# EasyEDA Pro project ProPrj_V1_2025-01-17.epro, schematic Schematic1
Board Name: Board1; Create Date: 2025-01-15; Page Name: P1; Project Name: V1; Schematic Name: Schematic1; Update Date: 2025-01-17; Company: 嘉立创EDA; Page Size: A4; Version: V1.1 ES
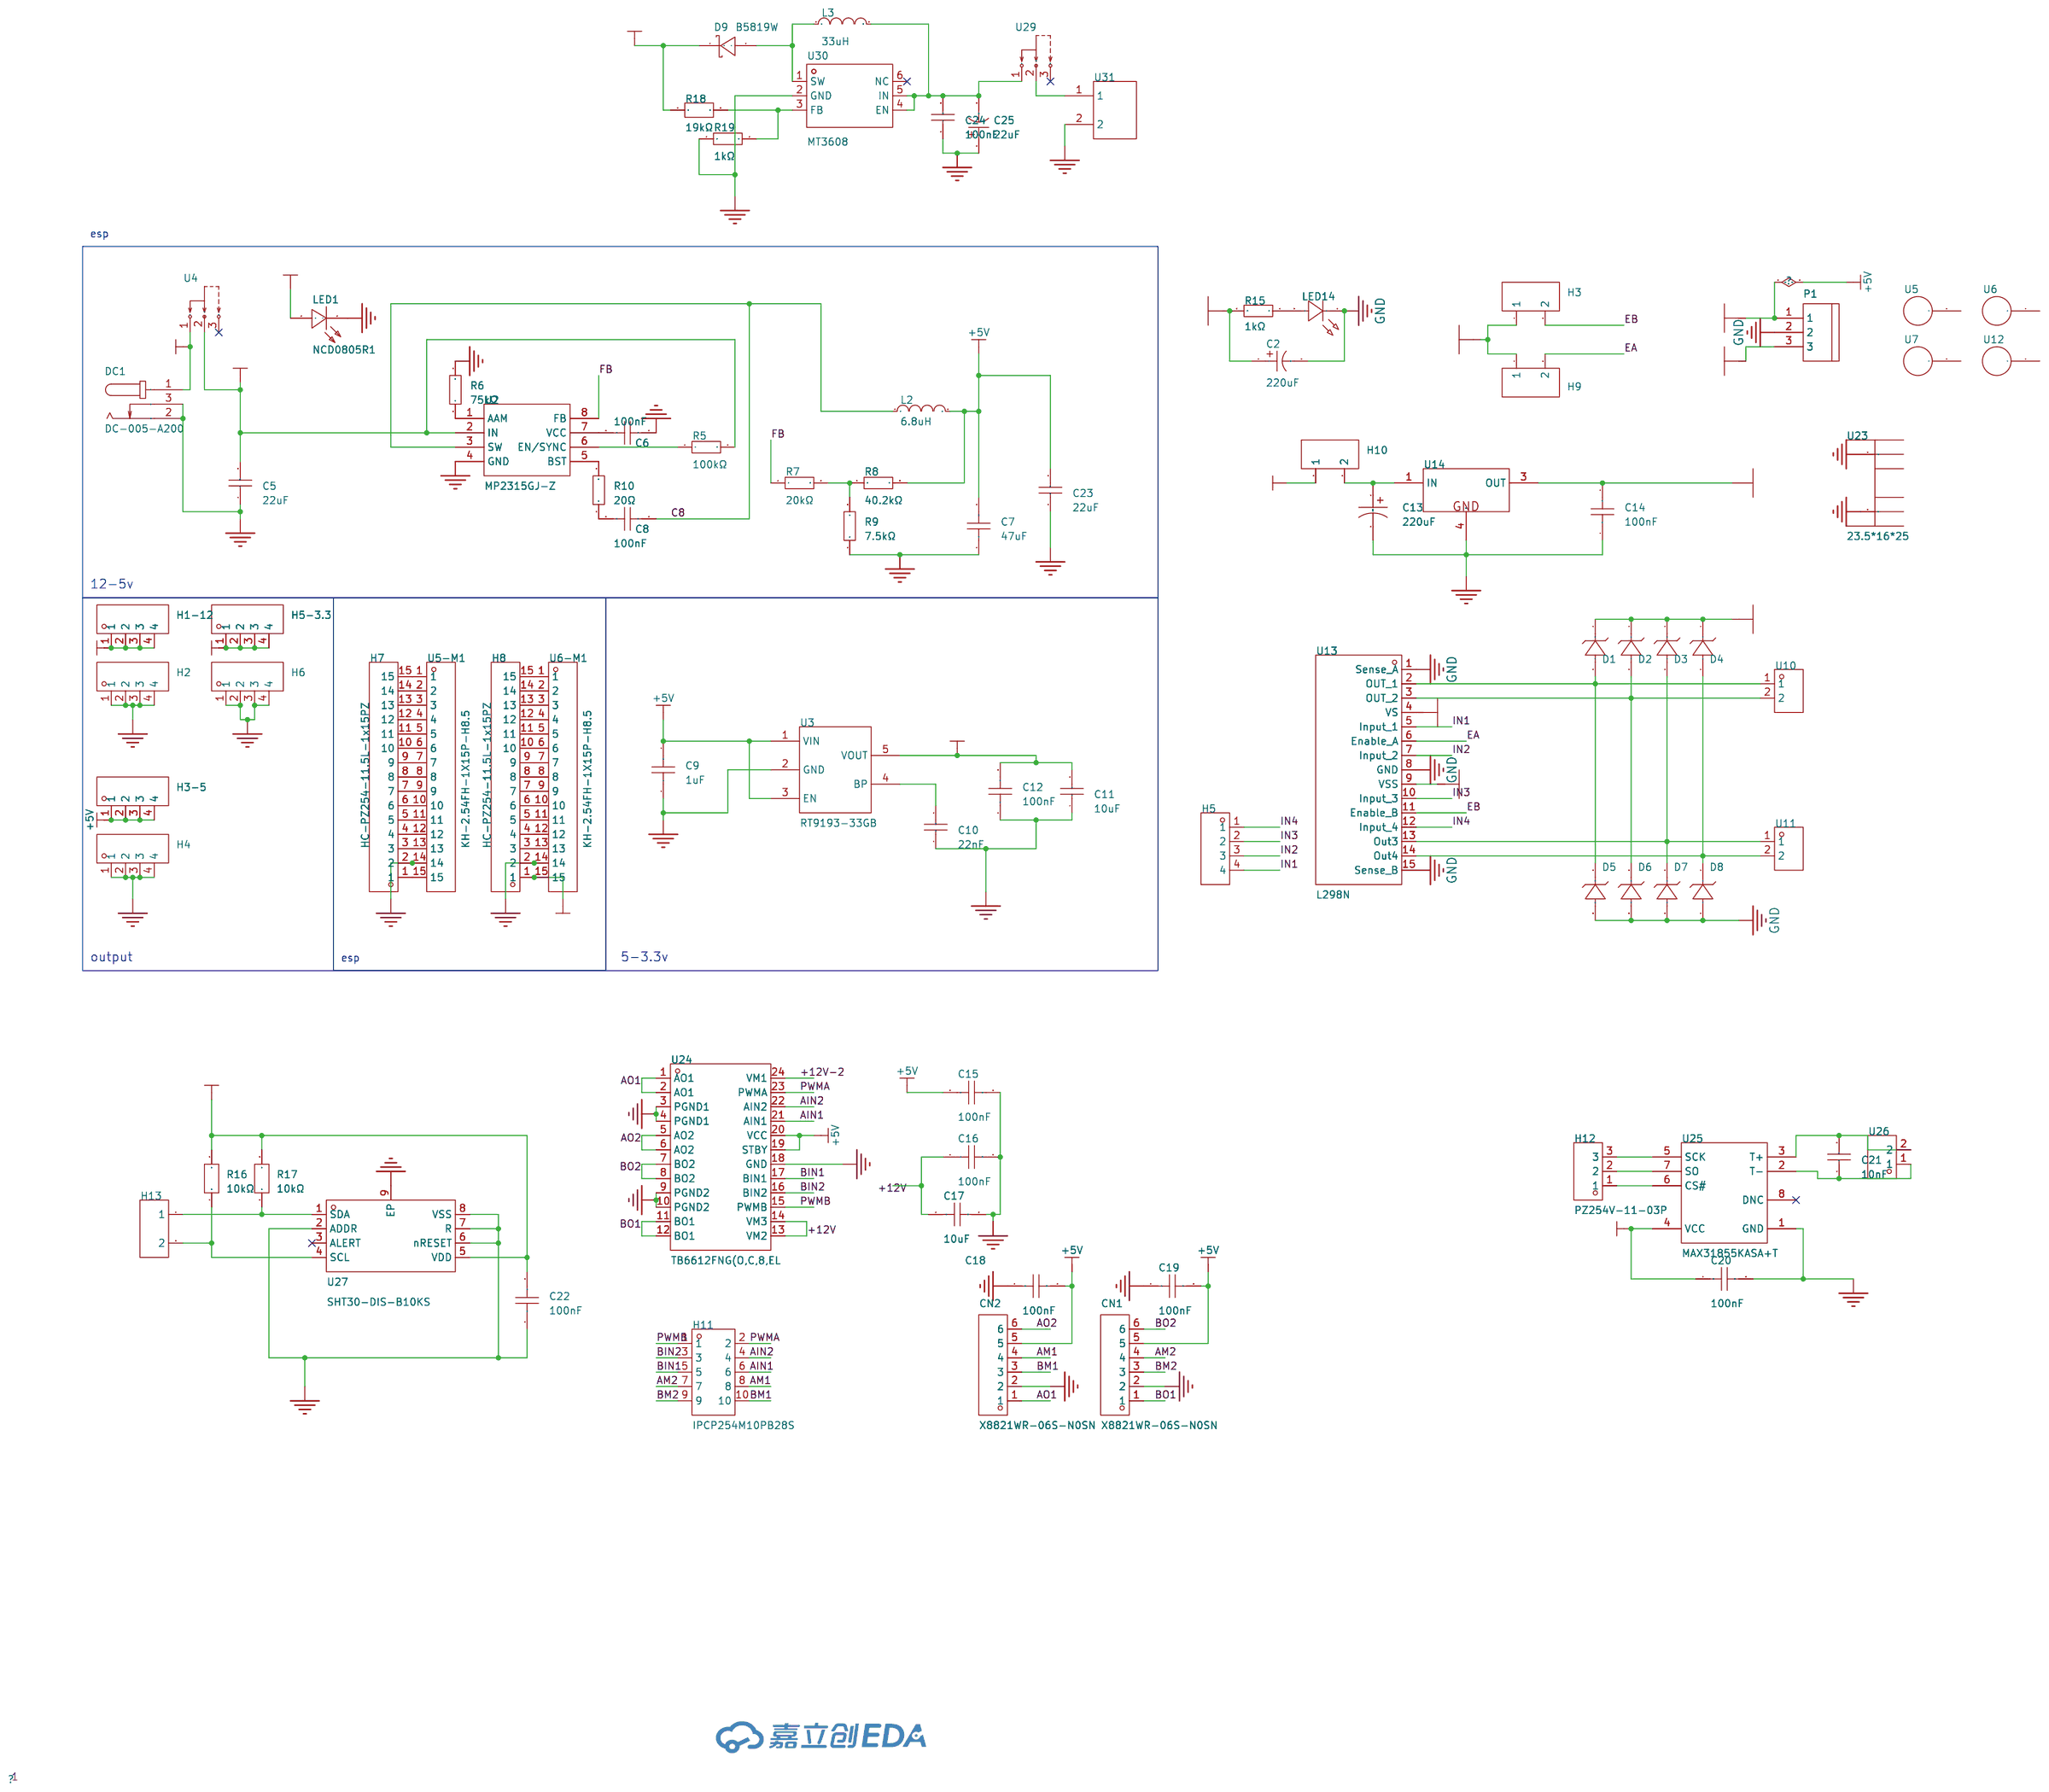
[diagram p0: schematic sheet]

## Parts
C2  220uF  [CAP-SMD_BD8.0-L8.3-W8.3-LS9.3-FD]
C5  22uF  [C1206]
C6  100nF  [C0603]
C7  47uF  [C1210]
C8  100nF  [C0603]
C9  1uF  [C0603]
C10  22nF  [C0603]
C11  10uF  [C1206]
C12  100nF  [C0603]
C13  220uF  [CAP-SMD_BD10.0-L10.3-W10.3-LS11.3-FD]
C14  100nF  [C0603]
C15  100nF  [C0603]
C16  100nF  [C0603]
C17  10uF  [C1206]
C18  100nF  [C0603]
C19  100nF  [C0603]
C20  100nF  [C0603]
C21  10nF  [C0603]
C22  100nF  [C0603]
C23  22uF  [C1206]
C24  100nF  [C0603]
C25  22uF  [CAP-SMD_BD6.3-L6.6-W6.6-FD]
CN1  X8821WR-06S-N0SN  [CONN-TH_6P-P2.50_X8821WR-06S-N2SN]
CN2  X8821WR-06S-N0SN  [CONN-TH_6P-P2.50_X8821WR-06S-N2SN]
D1  -  [SOD-123FL_L2.7-W1.8-LS3.8-RD]
D2  -  [SOD-123FL_L2.7-W1.8-LS3.8-RD]
D3  -  [SOD-123FL_L2.7-W1.8-LS3.8-RD]
D4  -  [SOD-123FL_L2.7-W1.8-LS3.8-RD]
D5  -  [SOD-123FL_L2.7-W1.8-LS3.8-RD]
D6  -  [SOD-123FL_L2.7-W1.8-LS3.8-RD]
D7  -  [SOD-123FL_L2.7-W1.8-LS3.8-RD]
D8  -  [SOD-123FL_L2.7-W1.8-LS3.8-RD]
D9  B5819W  [SOD-123_L2.8-W1.8-LS3.7-RD]
DC1  DC-005-A200  [DC-IN-TH_DC-005-A200]
H1-12  PZ254V-11-04P  [HDR-TH_4P-P2.54-V-M]
H2  PZ254V-11-04P  [HDR-TH_4P-P2.54-V-M]
H3  -  [HDR-TH_2P-P2.54-V-M-1]
H3-5  PZ254V-11-04P  [HDR-TH_4P-P2.54-V-M]
H4  PZ254V-11-04P  [HDR-TH_4P-P2.54-V-M]
H5  826629-4  [HDR-TH_4P-P2.54-V-M-1]
H5-3.3  PZ254V-11-04P  [HDR-TH_4P-P2.54-V-M]
H6  PZ254V-11-04P  [HDR-TH_4P-P2.54-V-M]
H7  HC-PZ254-11.5L-1x15PZ  [HDR-TH_15P-P2.54-V-M-1]
H8  HC-PZ254-11.5L-1x15PZ  [HDR-TH_15P-P2.54-V-M-1]
H9  -  [HDR-TH_2P-P2.54-V-M-1]
H10  -  [HDR-TH_2P-P2.54-V-M-1]
H11  IPCP254M10PB28S  [HDR-SMD_10P-P2.54-V-M-R2-C5-S2.54-LS7.3]
H12  PZ254V-11-03P  [HDR-TH_3P-P2.54-V-M]
H13  -  [HDR-TH_2P-P2.54-V-M-1]
L2  6.8uH  [IND-SMD_L7.0-W6.6]
L3  33uH  [IND-SMD_L12.3-W12.3]
LED1  NCD0805R1  [LED0805-R-RD]
LED14  -  [LED0805-RD_BLUE]
P1  -  [CONN-TH_3P-P5.00_WJ500V-5.08-3P]
R5  100kΩ  [R0603]
R6  75kΩ  [R0603]
R7  20kΩ  [R0603]
R8  40.2kΩ  [R0402]
R9  7.5kΩ  [R0603]
R10  20Ω  [R0805]
R15  1kΩ  [R0805]
R16  10kΩ  [R0603]
R17  10kΩ  [R0603]
R18  19kΩ  [R0805]
R19  1kΩ  [R0603]
U2  MP2315GJ-Z  [TSOT-23-8_L2.9-W1.6-P0.65-LS2.8-BR]
U3  RT9193-33GB  [SOT-23-5_L3.0-W1.7-P0.95-LS2.8-BL]
U4  SS12D10G5  [SW-TH_SHOU-HAN_SS12D10G4]
U5  -  [SMD_BD4.2-L4.7-W4.7-D3.0]
U5-M1  KH-2.54FH-1X15P-H8.5  [HDR-TH_15P-P2.54-V-F]
U6  -  [SMD_BD4.2-L4.7-W4.7-D3.0]
U6-M1  KH-2.54FH-1X15P-H8.5  [HDR-TH_15P-P2.54-V-F]
U7  -  [SMD_BD4.2-L4.7-W4.7-D3.0]
U10  -  [CONN-TH_DB302-5.0-2P]
U11  -  [CONN-TH_DB302-5.0-2P]
U12  -  [SMD_BD4.2-L4.7-W4.7-D3.0]
U13  L298N  [MULTIWATT-15_L19.6-W5.0-P1.27-L]
U14  L78M05ABDT-TR  [TO-252-2_L6.5-W6.1-P4.58-LS10.0-TL]
U23  23.5*16*25  [HEATSINK-TH_L23.5-W16.0-P18.0_XSD2156-067]
U24  TB6612FNG(O,C,8,EL  [SSOP-24_L8.4-W5.8-P0.65-LS7.8-BL]
U25  MAX31855KASA+T  [SO-8_L4.9-W3.9-P1.27-LS5.9-BL]
U26  -  [CONN-TH_DB302-5.0-2P]
U27  SHT30-DIS-B10KS  [DFN-8_L2.5-W2.5-P0.50-BL-EP]
U29  SS12D10G5  [SW-TH_SHOU-HAN_SS12D10G4]
U30  MT3608  [SOT-23-6_L2.9-W1.6-P0.95-LS2.8-BL]
U31  -  [PWR]

## Library data of the parts
C2 = EMK1VM221FB0D00R: 容值:220uF;精度:±20%;额定电压:35V;电容体直径:-;电容体长度:-;纹波电流:-;等效串联电阻:-;工作寿命:-;工作温度:-;; LCSC Part Name: 220uF ±20% 35V; Supplier Part: C724731; Manufacturer: AISHI(艾华集团); Supplier Footprint: SMD,8x10.5mm; JLCPCB Part Class: Extended Part; Datasheet: https://atta.szlcsc.com/upload/public/pdf/source/20200818/C724731_E3C3C738DF50876976EE53B5D20E1717.pdf; Supplier: LCSC; Tolerance: ±20%; Rated Voltage: 35V
C5 C23 = CL31A226KAHNNNE: 容值:22uF;精度:±10%;额定电压:25V;材质(温度系数):X5R;; LCSC Part Name: 22uF ±10% 25V; Supplier Part: C12891; Manufacturer: SAMSUNG(三星); Supplier Footprint: 1206; JLCPCB Part Class: 基础库; Datasheet: https://atta.szlcsc.com/upload/public/pdf/source/20160218/1457707763339.pdf; Supplier: LCSC; Tolerance: ±10%; Voltage Rated: 25V; Temperature Coefficient: X5R
C6 C8 C12 = CC0603KRX7R9BB104: 容值:100nF;精度:±10%;额定电压:50V;材质(温度系数):X7R;; LCSC Part Name: 100nF ±10% 50V; Supplier Part: C14663; Manufacturer: YAGEO(国巨); Supplier Footprint: 0603; JLCPCB Part Class: 基础库; Datasheet: https://atta.szlcsc.com/upload/public/pdf/source/20180910/C282072_33301C7F631E79921B82A8DAC6BCC5B3.pdf; Supplier: LCSC; Tolerance: ±10%; Voltage Rated: 50V; Temperature Coefficient: X7R
C7 = GRM32ER61C476KE15L: 容值:47uF;精度:±10%;额定电压:16V;材质(温度系数):X5R;; LCSC Part Name: 47uF ±10% 16V; Supplier Part: C77101; Manufacturer: muRata(村田); Supplier Footprint: 1210; JLCPCB Part Class: 扩展库; Datasheet: https://atta.szlcsc.com/upload/public/pdf/source/20221202/FF58125DCA7AB78AED268D88B743009A.pdf; Supplier: LCSC; Tolerance: ±10%; Voltage Rated: 16V; Temperature Coefficient: X5R
C9 = CL10A105KB8NNNC: 容值:1uF;精度:±10%;额定电压:50V;材质(温度系数):X5R;; LCSC Part Name: 1uF ±10% 50V; Supplier Part: C15849; Manufacturer: SAMSUNG(三星); Supplier Footprint: 0603; JLCPCB Part Class: Basic Part; Datasheet: https://atta.szlcsc.com/upload/public/pdf/source/20160218/1457707763339.pdf; Supplier: LCSC; Tolerance: ±10%; Voltage Rated: 50V; Temperature Coefficient: X5R
C10 = CL10B223KB8NNNC: 容值:22nF;精度:±10%;额定电压:50V;材质(温度系数):X7R;; LCSC Part Name: 22nF ±10% 50V; Supplier Part: C21122; Manufacturer: SAMSUNG(三星); Supplier Footprint: 0603; JLCPCB Part Class: 基础库; Datasheet: https://atta.szlcsc.com/upload/public/pdf/source/20160218/1457707763339.pdf; Supplier: LCSC; Tolerance: ±10%; Voltage Rated: 50V; Temperature Coefficient: X7R
C11 = CL31A106KBHNNNE: 容值:10uF;精度:±10%;额定电压:50V;材质(温度系数):X5R;; LCSC Part Name: 10uF ±10% 50V; Supplier Part: C13585; Manufacturer: SAMSUNG(三星); Supplier Footprint: 1206; JLCPCB Part Class: Basic Part; Datasheet: https://atta.szlcsc.com/upload/public/pdf/source/20160218/1457707763339.pdf; Supplier: LCSC; Tolerance: ±10%; Voltage Rated: 50V; Temperature Coefficient: X5R
C13 = HV1H227M1010PZ: 容值:220uF;精度:±20%;额定电压:50V;; LCSC Part Name: 220uF ±20% 50V; Supplier Part: C5246564; Manufacturer: HONOR(荣誉); Supplier Footprint: SMD,D10xL10mm; JLCPCB Part Class: 扩展库; Datasheet: https://atta.szlcsc.com/upload/public/pdf/source/20221103/F889AFCC379E96C645A0A58E4BAC43B0.pdf; Supplier: LCSC; Tolerance: ±20%; Rated Voltage: 50V; φD: 10mm; L: 10mm; Operating Temperature: -55℃~+105℃
C14-C16 C18-C20 C22 = CGA0603X7R104K500JT: 容值:100nF;精度:±10%;额定电压:50V;材质(温度系数):X7R;; LCSC Part Name: 100nF ±10% 50V; Supplier Part: C6119867; Manufacturer: HRE(芯声); Supplier Footprint: 0603; JLCPCB Part Class: 扩展库; Supplier: LCSC; Tolerance: ±10%; Voltage Rated: 50V; Temperature Coefficient: X7R
C17 = HGC1206R5106K500NSPJ: 容值:10uF;精度:±10%;额定电压:50V;材质(温度系数):X5R;; LCSC Part Name: 10uF ±10% 50V; Supplier Part: C7432781; Manufacturer: Chinocera(华瓷); Supplier Footprint: 1206; JLCPCB Part Class: 扩展库; Datasheet: https://atta.szlcsc.com/upload/public/pdf/source/20240320/FAC3FEC40A78BC5CCCE96C232A94D860.pdf; Supplier: LCSC; Tolerance: ±10%; Voltage Rated: 50V; Temperature Coefficient: X5R
C21 = CC0603KRX7R9BB103: 容值:10nF;精度:±10%;额定电压:50V;材质(温度系数):X7R;; LCSC Part Name: 10nF ±10% 50V; Supplier Part: C100042; Manufacturer: YAGEO(国巨); Supplier Footprint: 0603; JLCPCB Part Class: 扩展库; Datasheet: https://atta.szlcsc.com/upload/public/pdf/source/20181008/C309510_22F155564471FAF6A489F7D68F34234E.pdf; Supplier: LCSC; Tolerance: ±10%; Voltage Rated: 50V; Temperature Coefficient: X7R
C24 = CT41G-0603-2X1-50V-0.1μF-K(N): 容值:100nF;精度:±10%;额定电压:50V;材质(温度系数):-;; LCSC Part Name: 100nF ±10% 50V; Supplier Part: C125205; Manufacturer: TORCH(火炬); Supplier Footprint: 0603; JLCPCB Part Class: 扩展库; Datasheet: https://atta.szlcsc.com/upload/public/pdf/source/20171225/C150708_15141883600121203188.pdf; Supplier: LCSC; Tolerance: ±10%; Voltage Rated: 50V
C25 = RVT22UF50V67RV0028: 容值:22uF;精度:±20%;额定电压:50V;纹波电流:43mA@120Hz;等效串联电阻:-;; LCSC Part Name: 22uF ±20% 50V; Supplier Part: C2836438; Manufacturer: KNSCHA(科尼盛); Supplier Footprint: SMD,D6.3xL5.4mm; JLCPCB Part Class: 扩展库; Datasheet: https://atta.szlcsc.com/upload/public/pdf/source/20210528/C2836438_BFA13B3627CC6B20ADD0B3BB98082A71.pdf; Supplier: LCSC; Tolerance: ±20%; Rated Voltage: 50V; Ripple Current: 43mA@120Hz; φD: 6.3mm; L: 5.4mm; Lifetime @ Temp: 2000hrs@105℃; Operating Temperature: -55℃~+105℃
CN1 CN2 = X8821WR-06S-N0SN: 插针结构:1x6P;间距:2.5mm;安装方式:弯插;参考系列:XH;总PIN数:6P;排数:1;每排PIN数:6;行距:-;额定电流:3A;触头材质:黄铜;触头镀层:锡;工作温度范围:-;; LCSC Part Name: 1x6P 间距:2.5mm 弯插 系列:XH; Supplier Part: C388743; Manufacturer: XKB Connection(中国星坤); Supplier Footprint: 弯插,P=2.54mm; JLCPCB Part Class: 扩展库; Datasheet: https://atta.szlcsc.com/upload/public/pdf/source/20211009/984C14C41D2B1156BCF8EEF5D296E395.pdf; Supplier: LCSC; Pins Structure: 1x6P; Pitch: 2.5mm; Mounting Style: 弯插; Reference Series: XH; Number of Pins: 6P; Number of Rows: 1; Number of PINs Per Row: 6; Current Rating (Max): 3A; Contact Material: 黄铜; Contact Plating: 锡
D1-D8 = 1N4007: 二极管配置:独立式;直流反向耐压(Vr):1kV;平均整流电流(Io):1A;正向压降(Vf):1.1V@1A;反向电流(Ir):10A@1kV;; LCSC Part Name: 1kV 1A 1.1V@1A; Supplier Part: C727082; Manufacturer: TWGMC(台湾迪嘉); Supplier Footprint: SOD-123FL; JLCPCB Part Class: Extended Part; Datasheet: https://atta.szlcsc.com/upload/public/pdf/source/20200828/C727082_2F914037E829F0E2238583225D7ED281.pdf; Supplier: LCSC; Diode Configuration: 独立式; Reverse Voltage (Vr): 1kV; Average Rectified Current (Io): 1A; Forward Voltage (Vf@If): 1.1V@1A; Reverse Leakage Current: 10A@1kV
D9 = B5819W_C64885: 二极管配置:独立式;正向压降(Vf):900mV@3A;直流反向耐压(Vr):40V;整流电流:1A;; LCSC Part Name: 电压:40V 电流:1A 丝印SL; Supplier Part: C64885; Manufacturer: MDD(辰达半导体); Supplier Footprint: SOD-123; JLCPCB Part Class: 扩展库; Datasheet: https://atta.szlcsc.com/upload/public/pdf/source/20241121/1336DB1C0E60AD8FEBA9F692F8955C35.pdf; Supplier: LCSC; Diode Configuration: 独立式; Forward Voltage (Vf@If): 900mV@3A; Reverse Voltage (Vr): 40V; Rectified Current: 1A; Reverse Leakage Current (Ir): 1mA@40V
DC1 = DC-005-A200: 连接器类型:DC电源插座;安装方式:弯插;触点内径:2mm;触点外径:6.4mm;额定电流:3A;额定电压:30V;工作温度范围:-20℃~+70℃;; LCSC Part Name: DC电源插座 内径:2mm 外径:6.4mm; Supplier Part: C720557; Manufacturer: XUNPU(讯普); Supplier Footprint: 插件; JLCPCB Part Class: Extended Part; Datasheet: https://atta.szlcsc.com/upload/public/pdf/source/20200812/C720557_2286DFCD6C75B71AF905731F627ABF3A.pdf; Supplier: LCSC; Connector Type: DC电源插座; Mounting Style: 弯插; Inside Contact Diameter: 2mm; Outside Contact Diameter: 6.4mm; Current Rating (Max): 3A; Voltage Rating (Max): 30V; Operating Temperature Range: -20℃~+70℃
H1-12 H2 H3-5 H4 H5-3.3 H6 = PZ254V-11-04P: 插针结构:1x4P;间距:2.54mm;行距:-;圆针/方针:方针;安装类型:直插;排数:单排;总PIN位数:4P;额定电流:3A;额定电压:250V;配合针长度:6mm;塑高:2.5mm;端接针长度:3mm;触头材质:-;工作温度范围:-40℃~+105℃;颜色:黑色;; LCSC Part Name: 间距:2.54mm 1x4P 直插 方针; Supplier Part: C2691448; Manufacturer: XFCN(兴飞); Supplier Footprint: 插件,P=2.54mm; JLCPCB Part Class: 扩展库; Datasheet: https://atta.szlcsc.com/upload/public/pdf/source/20200309/C492403_F9F19131791D08044AD4F84F8E751A34.pdf; Supplier: LCSC; Pin Structure: 1x4P; Pitch: 2.54mm; Circluar Pins/Square Pins: 方针; Mounting Type: 直插; Number of Rows: 单排; Number of Pins: 4P; Current Rating (Max): 3A; Voltage Rating (Max): 250V; Length of Mating Pin: 6mm; Insulation Height: 2.5mm; Length of End Connection Pin: 3mm; Operating Temperature Range: -40℃~+105℃; Color: 黑色
H3 H9 H10 H13 = 826629-2: 间距:2.54mm;总PIN位数:2;排数:1;插针结构:-;行距:-;安装类型:直插;圆针/方针:-;额定电流:-;额定电压:-;配合针长度:-;塑高:-;触头材质:黄铜;触头镀层:-;颜色:绿色;; LCSC Part Name: 2.54mm 分离式  金; Supplier Part: C86471; Manufacturer: TE Connectivity(美国泰科); Supplier Footprint: 插件; JLCPCB Part Class: Extended Part; Datasheet: https://atta.szlcsc.com/upload/public/pdf/source/20161105/1478330325829.pdf; Supplier: LCSC; Pitch: 2.54mm; Number of Pins: 2; Number of Rows: 1; Mounting Type: 直插; Contact Material: 黄铜; Color: 绿色
H5 = 826629-4: 排数:单排;总PIN位数:4;间距:2.54mm;插针结构:1x4P;行距:-;安装类型:直插;圆针/方针:-;额定电流:-;额定电压:-;配合针长度:6.7mm;塑高:2.8mm;端接针长度:3.2mm;触头材质:-;工作温度范围:-;颜色:绿色;; LCSC Part Name: 2.54mm 1x4P 直插; Supplier Part: C590277; Manufacturer: TE Connectivity(美国泰科); Supplier Footprint: 插件,P=2.54mm; JLCPCB Part Class: Extended Part; Datasheet: https://atta.szlcsc.com/upload/public/pdf/source/20210923/FCC8CD9A04BA2624CF68C067B4A5B53A.pdf; Supplier: LCSC; Number of Rows: 单排; Number of Pins: 4; Pitch: 2.54mm; Pin Structure: 1x4P; Mounting Type: 直插; Length of Mating Pin: 6.7mm; Insulation Height: 2.8mm; Length of End Connection Pin: 3.2mm; Color: 绿色
H7 H8 = HC-PZ254-11.5L-1x15PZ: 插针结构:1x15P;间距:2.54mm;行距:-;圆针/方针:方针;安装类型:直插;排数:单排;总PIN位数:15P;额定电流:3A;配合针长度:6mm;塑高:2.5mm;端接针长度:3mm;触头材质:黄铜;触头镀层:金;工作温度范围:-40℃~+105℃;颜色:黑色;; LCSC Part Name: 间距2.54mm 1x15Pin 直插 H2.5 L11.5; Supplier Part: C41375938; Manufacturer: HC(虹成电子); Supplier Footprint: 插件,P=2.54mm; Datasheet: https://atta.szlcsc.com/upload/public/pdf/source/20240830/E8D82617C607A62AEA7031AC45ADC5FF.pdf; Supplier: LCSC; Pin Structure: 1x15P; Pitch: 2.54mm; Circluar Pins/Square Pins: 方针; Mounting Type: 直插; Number of Rows: 单排; Number of Pins: 15P; Current Rating (Max): 3A; Length of Mating Pin: 6mm; Insulation Height: 2.5mm; Length of End Connection Pin: 3mm; Contact Material: 黄铜; Contact Plating: 金; Operating Temperature Range: -40℃~+105℃; Color: 黑色
H11 = IPCP254M10PB28S: 插针结构:2x5P;间距:2.54mm;行距:2.54mm;圆针/方针:方针;安装类型:立贴;排数:双排;总PIN位数:10P;额定电流:3A;额定电压:-;塑高:2.5mm;触头材质:黄铜;触头镀层:金;工作温度范围:-40℃~+105℃;颜色:黑色;; LCSC Part Name: 2x5P 间距:2.54mm 方针 立贴; Supplier Part: C22438449; Manufacturer: INCP; Supplier Footprint: SMD,P=2.54mm; JLCPCB Part Class: 扩展库; Datasheet: https://atta.szlcsc.com/upload/public/pdf/source/20240509/094DB0710888307F3FE8E0964C322F79.pdf; Supplier: LCSC; Pin Structure: 2x5P; Pitch: 2.54mm; Row Spacing: 2.54mm; Circluar Pins/Square Pins: 方针; Mounting Type: 立贴; Number of Rows: 双排; Number of Pins: 10P; Current Rating (Max): 3A; Insulation Height: 2.5mm; Contact Material: 黄铜; Contact Plating: 金; Operating Temperature Range: -40℃~+105℃; Color: 黑色
H12 = PZ254V-11-03P: 插针结构:1x3P;间距:2.54mm;行距:-;圆针/方针:方针;安装类型:直插;排数:单排;总PIN位数:3P;额定电流:3A;额定电压:250V;配合针长度:6mm;塑高:2.5mm;端接针长度:3mm;工作温度范围:-40℃~+105℃;颜色:黑色;; LCSC Part Name: 间距:2.54mm 1x3P 直插 方针; Supplier Part: C2937625; Manufacturer: XFCN(兴飞); Supplier Footprint: 插件,P=2.54mm; JLCPCB Part Class: 扩展库; Datasheet: https://atta.szlcsc.com/upload/public/pdf/source/20200309/C492402_8335C3D49C4E4C618838D59BB1D024C1.pdf; Supplier: LCSC; Pin Structure: 1x3P; Pitch: 2.54mm; Circluar Pins/Square Pins: 方针; Mounting Type: 直插; Number of Rows: 单排; Number of Pins: 3P; Current Rating (Max): 3A; Voltage Rating (Max): 250V; Length of Mating Pin: 6mm; Insulation Height: 2.5mm; Length of End Connection Pin: 3mm; Operating Temperature Range: -40℃~+105℃; Color: 黑色
L2 = FXL0630-6R8-M: 电感值:6.8uH;精度:±20%;额定电流:5A;饱和电流(Isat):6A;类型:一体成型电感;; LCSC Part Name: 6.8uH ±20% 6A; Supplier Part: C167221; Manufacturer: cjiang(长江微电); Supplier Footprint: SMD,6.6x7mm; JLCPCB Part Class: 扩展库; Datasheet: https://atta.szlcsc.com/upload/public/pdf/source/20230516/3A080F5AF8C87BB81C3BA86E5F60E51A.pdf; Supplier: LCSC; Tolerance: ±20%; Rated Current: 5A; Saturation Current (Isat): 6A; DC Resistance (DCR): 48mΩ; Type: 一体成型电感
L3 = SMDRI127-330MT: 电感值:33uH;精度:±20%;额定电流:3A;饱和电流(Isat):5.5A;类型:屏蔽电感;; LCSC Part Name: 33uH ±20% 5.5A; Supplier Part: C9400; Manufacturer: SXN(顺翔诺); Supplier Footprint: SMD,12.3x12.3mm; JLCPCB Part Class: 扩展库; Datasheet: https://atta.szlcsc.com/upload/public/pdf/source/20210810/6F96FDC19AA308DD2AD166FFB9640E87.pdf; Supplier: LCSC; Tolerance: ±20%; Rated Current: 3A; Saturation Current (Isat): 5.5A; DC Resistance (DCR): 65mΩ; Type: 屏蔽电感
LED1 = NCD0805R1: 灯头类型:-;发光颜色:红色;正向电压(VF):1.6V~2.6V;功率:65mW;正向电流:20mA;主波长:615nm~630nm;二极管配置:独立二极管;透镜颜色:无色透明透镜;色温:-;发光强度:67mcd~195mcd;发光角度:130°;载带方式:-;工作温度:-30℃~+85℃;; Supplier Part: C84256; Manufacturer: 国星光电; Supplier Footprint: 0805; JLCPCB Part Class: 基础库; Datasheet: https://atta.szlcsc.com/upload/public/pdf/source/20200820/C84256_F0A75A43B3EAD75808600A0514C76B99.pdf; Supplier: LCSC; Emitted Color: 红色; Forward Voltage (VF): 1.6V~2.6V; Power Dissipation: 65mW; Forward Current: 20mA; Dominant Wavelength: 615nm~630nm; Diode Configuration: 独立二极管; Lens Color: 无色透明透镜; Luminous Intensity: 67mcd~195mcd; Viewing Angle: 130°; Operating Temperature: -30℃~+85℃
LED14 = RF-BGB170TS-CB-E0: 发光颜色:蓝灯;二极管配置:-;透镜颜色:-;主波长:-;峰值波长:-;色温:-;光通量(25时):-;测试电流:20mA;正向电压(VF):-;发光强度:-;功率:70mW;发光角度:140°;安装方式:正贴;工作温度:-40~+85;; LCSC Part Name: 蓝灯 正贴; Supplier Part: C2908306; Manufacturer: Refond(瑞丰); Supplier Footprint: 0805; JLCPCB Part Class: Extended Part; Datasheet: https://atta.szlcsc.com/upload/public/pdf/source/20211101/C871A18E9B6E101B84BDF0C661245F86.pdf; Supplier: LCSC; Emitted Color: 蓝灯; Forward Current: 20mA; Power Dissipation: 70mW; Viewing Angle: 140°; Mounting Sytle: 正贴; Operating Temperature: -40~+85
P1 = WJ500V-5.08-3P: 间距:5.08mm;排数:1;每排PIN数:3;安装方式:直针;额定电流:18A;额定电压:250V;线规 - AWG:14~30;线规 - mm?:2.5;工作温度范围:-40~+105;颜色:绿色;; LCSC Part Name: 5.08mm 排数:1 每排P数:3 直针 可拼接; Supplier Part: C72334; Manufacturer: KANGNEX(康奈克斯电气); Supplier Footprint: P=5.08mm; JLCPCB Part Class: Extended Part; Datasheet: https://atta.szlcsc.com/upload/public/pdf/source/20191225/C72334_8A5EF831D67650233B6B1E3F2BC06274.pdf; Supplier: LCSC; Pitch: 5.08mm; Number of Rows: 1; Number of PINs Per Row: 3; Mounting Style: 直针; Current Rating (Max): 18A; Voltage Rating (Max): 250V; Wire Gauge - AWG: 14~30; Wire Gauge - mm?: 2.5; Operating Temperature Range: -40~+105; Color: 绿色
R5 = RC0603FR-07100KL: 电阻类型:厚膜电阻;阻值:100kΩ;精度:±1%;功率:100mW;最大工作电压:75V;温度系数:±100ppm/℃;; LCSC Part Name: 厚膜电阻 100kΩ ±1% 100mW; Supplier Part: C14675; Manufacturer: YAGEO(国巨); Supplier Footprint: 0603; JLCPCB Part Class: 扩展库; Datasheet: https://atta.szlcsc.com/upload/public/pdf/source/20140324/1457707028752.pdf; Supplier: LCSC; Type: 厚膜电阻; Tolerance: ±1%; Power(Watts): 100mW; Overload Voltage (Max): 75V; Temperature Coefficient: ±100ppm/℃; Operating Temperature Range: -55℃~+155℃
R6 = 0603WAF7502T5E: 电阻类型:厚膜电阻;阻值:75kΩ;精度:±1%;功率:100mW;最大工作电压:75V;温度系数:±100ppm/℃;; LCSC Part Name: 75kΩ ±1% 100mW 厚膜电阻; Supplier Part: C23242; Manufacturer: UNI-ROYAL(厚声); Supplier Footprint: 0603; JLCPCB Part Class: 基础库; Datasheet: https://atta.szlcsc.com/upload/public/pdf/source/20200306/C422600_1E6D84923E4A46A82E41ADD87F860B5C.pdf; Supplier: LCSC; Type: 厚膜电阻; Tolerance: ±1%; Power(Watts): 100mW; Overload Voltage (Max): 75V; Temperature Coefficient: ±100ppm/℃; Operating Temperature Range: -55℃~+155℃
R7 = 0603WAF2002T5E: 电阻类型:厚膜电阻;阻值:20kΩ;精度:±1%;功率:100mW;最大工作电压:75V;温度系数:±100ppm/℃;; LCSC Part Name: 20kΩ ±1% 100mW 厚膜电阻; Supplier Part: C4184; Manufacturer: UNI-ROYAL(厚声); Supplier Footprint: 0603; JLCPCB Part Class: Basic Part; Datasheet: https://atta.szlcsc.com/upload/public/pdf/source/20200306/C422600_1E6D84923E4A46A82E41ADD87F860B5C.pdf; Supplier: LCSC; Type: 厚膜电阻; Tolerance: ±1%; Power(Watts): 100mW; Overload Voltage (Max): 75V; Temperature Coefficient: ±100ppm/℃; Operating Temperature Range: -55℃~+155℃
R8 = 0402WGF4022TCE: 电阻类型:厚膜电阻;阻值:40.2kΩ;精度:±1%;功率:62.5mW;最大工作电压:50V;温度系数:±100ppm/℃;; LCSC Part Name: 40.2kΩ ±1% 62.5mW 厚膜电阻; Supplier Part: C25893; Manufacturer: UNI-ROYAL(厚声); Supplier Footprint: 0402; JLCPCB Part Class: 扩展库; Datasheet: https://atta.szlcsc.com/upload/public/pdf/source/20200306/C422600_1E6D84923E4A46A82E41ADD87F860B5C.pdf; Supplier: LCSC; Type: 厚膜电阻; Tolerance: ±1%; Power(Watts): 62.5mW; Overload Voltage (Max): 50V; Temperature Coefficient: ±100ppm/℃; Operating Temperature Range: -55℃~+155℃
R9 = 0603WAF7501T5E: 电阻类型:厚膜电阻;阻值:7.5kΩ;精度:±1%;功率:100mW;最大工作电压:75V;温度系数:±100ppm/℃;; LCSC Part Name: 7.5kΩ ±1% 100mW 厚膜电阻; Supplier Part: C23234; Manufacturer: UNI-ROYAL(厚声); Supplier Footprint: 0603; JLCPCB Part Class: 基础库; Datasheet: https://atta.szlcsc.com/upload/public/pdf/source/20200306/C422600_1E6D84923E4A46A82E41ADD87F860B5C.pdf; Supplier: LCSC; Type: 厚膜电阻; Tolerance: ±1%; Power(Watts): 100mW; Overload Voltage (Max): 75V; Temperature Coefficient: ±100ppm/℃; Operating Temperature Range: -55℃~+155℃
R10 = 0805W8F200JT5E: 电阻类型:厚膜电阻;阻值:20Ω;精度:±1%;功率:125mW;最大工作电压:150V;温度系数:±200ppm/℃;; LCSC Part Name: 20Ω ±1% 125mW 厚膜电阻; Supplier Part: C17544; Manufacturer: UNI-ROYAL(厚声); Supplier Footprint: 0805; JLCPCB Part Class: 基础库; Datasheet: https://atta.szlcsc.com/upload/public/pdf/source/20200306/C422600_1E6D84923E4A46A82E41ADD87F860B5C.pdf; Supplier: LCSC; Type: 厚膜电阻; Tolerance: ±1%; Power(Watts): 125mW; Overload Voltage (Max): 150V; Temperature Coefficient: ±200ppm/℃; Operating Temperature Range: -55℃~+155℃
R15 = RS-05K102JT: 阻值:1kΩ;精度:±5%;功率:125mW;温度系数:±100ppm/;最大工作电压:150V;工作温度范围:-55~+155;; LCSC Part Name: 1kΩ ±5%; Supplier Part: C115302; Manufacturer: FH(风华); Supplier Footprint: 0805; JLCPCB Part Class: Extended Part; Datasheet: https://atta.szlcsc.com/upload/public/pdf/source/20170704/1499151304704.pdf; Supplier: LCSC; Tolerance: ±5%; Power(Watts): 125mW; Temperature Coefficient: ±100ppm/; Overload Voltage (Max): 150V; Operating Temperature Range: -55~+155
R16 R17 = FRC0603J103TS: 电阻类型:厚膜电阻;阻值:10kΩ;精度:±5%;功率:100mW;最大工作电压:75V;温度系数:±100ppm/℃;; LCSC Part Name: 10kΩ ±5% 100mW 厚膜电阻; Supplier Part: C2930027; Manufacturer: FOJAN(富捷); Supplier Footprint: 0603; JLCPCB Part Class: 扩展库; Datasheet: https://atta.szlcsc.com/upload/public/pdf/source/20211221/925EC7D7225764EE0046F22065062C87.pdf; Supplier: LCSC; Type: 厚膜电阻; Tolerance: ±5%; Power(Watts): 100mW; Overload Voltage (Max): 75V; Temperature Coefficient: ±100ppm/℃; Operating Temperature Range: -55℃~+155℃
R18 = FRC0805F1902TS: 电阻类型:厚膜电阻;阻值:19kΩ;精度:±1%;功率:125mW;最大工作电压:150V;温度系数:±100ppm/℃;; LCSC Part Name: 19kΩ ±1% 125mW 厚膜电阻; Supplier Part: C2930177; Manufacturer: FOJAN(富捷); Supplier Footprint: 0805; JLCPCB Part Class: 扩展库; Datasheet: https://atta.szlcsc.com/upload/public/pdf/source/20211221/925EC7D7225764EE0046F22065062C87.pdf; Supplier: LCSC; Type: 厚膜电阻; Tolerance: ±1%; Power(Watts): 125mW; Overload Voltage (Max): 150V; Temperature Coefficient: ±100ppm/℃; Operating Temperature Range: -55℃~+155℃
R19 = 0603WAF1001T5E: 电阻类型:厚膜电阻;阻值:1kΩ;精度:±1%;功率:100mW;最大工作电压:75V;温度系数:±100ppm/℃;; LCSC Part Name: 1kΩ ±1% 100mW 厚膜电阻; Supplier Part: C21190; Manufacturer: UNI-ROYAL(厚声); Supplier Footprint: 0603; JLCPCB Part Class: Basic Part; Datasheet: https://atta.szlcsc.com/upload/public/pdf/source/20200306/C422600_1E6D84923E4A46A82E41ADD87F860B5C.pdf; Supplier: LCSC; Type: 厚膜电阻; Tolerance: ±1%; Power(Watts): 100mW; Overload Voltage (Max): 75V; Temperature Coefficient: ±100ppm/℃; Operating Temperature Range: -55℃~+155℃
U2 = MP2315GJ-Z: 功能类型:降压型;输出类型:可调;输入电压:4.5V~24V;输出电压:800mV~22.8V;输出电流(最大值):3A;; Supplier Part: C45889; Manufacturer: MPS(芯源); Supplier Footprint: TSOT-23-8; JLCPCB Part Class: 扩展库; Datasheet: https://atta.szlcsc.com/upload/public/pdf/source/20240315/E986BDF075E08D3649664A84BD5F173B.pdf; Supplier: LCSC; Function: 降压型; Output Type: 可调; Input Voltage: 4.5V~24V; Output Voltage: 800mV~22.8V; Output Current (Max): 3A; Switching Frequency: 500kHz; Operating Temperature: -40℃~+125℃@(TJ); Synchronous Rectification: 是; Number of Outputs: 1; Topology: 降压式; Switch tube (built-in/external): 内置
U3 = RT9193-33GB: 输出类型:固定;最大输入电压:5.5V;输出电压:3.3V;最大输出电流:300mA;电源纹波抑制比(PSRR):70dB;输出极性:正极;; LCSC Part Name: 输入5.5V 输出3.3V 300mA; Supplier Part: C15651; Manufacturer: RICHTEK(立锜); Supplier Footprint: SOT-23-5; JLCPCB Part Class: 扩展库; Datasheet: https://atta.szlcsc.com/upload/public/pdf/source/20130730/1457706628575.pdf; Supplier: LCSC; Output Type: 固定; Maximum Input Voltage: 5.5V; Output Voltage: 3.3V; MAX Output Current: 300mA; Power Supply Rejection Ratio (PSRR): 70dB; Dropout Voltage: 300mV@(300mA); standby current: 130uA; Operating Temperature: -40℃~+125℃; Output Polarity: 正极; Number of Outputs: 1
U4 U29 = SS12D10G5: 电路结构:单刀双掷;安装方式:直插;额定电流(DC):2A;额定电压(DC):125V;机械寿命:3千次;; LCSC Part Name: 两档立式插件 3脚拨动开关 柄长5.0mm; Supplier Part: C7431054; Manufacturer: SHOU HAN(首韩); Supplier Footprint: 插件; JLCPCB Part Class: 扩展库; Datasheet: https://atta.szlcsc.com/upload/public/pdf/source/20231130/7A3DB6A149BF0A1DCFFE64FFC07FE434.pdf; Supplier: LCSC; Circuit: 单刀双掷; Switch Length: 12.7mm; Switch Width: 6.7mm; Mounting Style: 直插; Current Rating (DC): 2A; Voltage Rating (DC): 125V; Mechanical Life: 3千次; Operating Temperature: -25℃~+70℃
U5-U7 U12 = 铜柱M3*5+6: 螺柱类型:单通螺柱;公称直径:M3;螺距:-;长度:11mm;执行标准:-;强度等级:-;材料:-;表面处理:-;; Supplier Part: C87703; Manufacturer: 国产; Supplier Footprint: M3*5+6; JLCPCB Part Class: Extended Part; Datasheet: https://atta.szlcsc.com/upload/public/pdf/source/20180629/C87703_D0202CF0C285C70F41F1E6F27424EC8C.pdf; Supplier: LCSC; Bolts Type: 单通螺柱; Nominal Diameter: M3; Length: 11mm
U5-M1 U6-M1 = KH-2.54FH-1X15P-H8.5: 插孔结构:1x15P;间距:2.54mm;行距:-;圆孔/方孔:方孔;安装类型:直插;排数:单排;总孔位数:15P;额定电流:3A;额定电压:-;插孔方向:顶部;塑高:8.5mm;工作温度范围:-40℃~+105℃;; LCSC Part Name: 间距:2.54mm 1x15P 直插; Supplier Part: C2932676; Manufacturer: kinghelm(金航标); Supplier Footprint: 插件,P=2.54mm; JLCPCB Part Class: 扩展库; Datasheet: https://atta.szlcsc.com/upload/public/pdf/source/20211220/977AA415CFA981E866620A80068F25CA.pdf; Supplier: LCSC; Holes Structure: 1x15P; Pitch: 2.54mm; Circular Hole / Square Hole: 方孔; Mounting Type: 直插; Number of Rows: 单排; Number of Holes: 15P; Current Rating (Max): 3A; Holes Direction: 顶部; Insulation Height: 8.5mm; Operating Temperature Range: -40℃~+105℃
U10 U11 U26 = DB302-5.0-2P-GN-S: LCSC Part Name: 2P P=5mm; Supplier Part: C2997275; Manufacturer: DIBO(地博电气); Supplier Footprint: P=5mm; JLCPCB Part Class: Extended Part; Datasheet: https://atta.szlcsc.com/upload/public/pdf/source/20220418/F63E4822E301FF035E2D9136E480A4B5.pdf; Supplier: LCSC
U13 = L298N_C19922: 电源电压:4.5V~7V;特性:过流保护(OCP)；过热保护(OPT);; Supplier Part: C19922; Manufacturer: ST(意法半导体); Supplier Footprint: Multiwatt-15-V; JLCPCB Part Class: Extended Part; Datasheet: https://atta.szlcsc.com/upload/public/pdf/source/20131014/1457706655076.pdf; Supplier: LCSC; Supply Voltage: 4.5V~7V; Feature: 过流保护(OCP)；过热保护(OPT); Operating Temperature: -40℃~+150℃@(Tj)
U14 = L78M05ABDT-TR: L78M Series 500 mA 5 V Three Terminal Positive Voltage LDO Regulator - TO-252; Supplier Part: C58069; Manufacturer: ST(意法半导体); Supplier Footprint: TO-252-2(DPAK); JLCPCB Part Class: Basic Part; Datasheet: https://atta.szlcsc.com/upload/public/pdf/source/20150912/1457707362652.pdf; Supplier: LCSC
U23 = 23.5*16*25: 产品尺寸:23.5*16*25MM;材 质:6063-T5铝;; LCSC Part Name: 23.5*16*25   2个钉散热片; Supplier Part: C4661; Manufacturer: XSD(鑫顺达); JLCPCB Part Class: 扩展库; Datasheet: https://atta.szlcsc.com/upload/public/pdf/source/20180404/C4661_AA4279CA2C163B7D4FDABF987BD2FAA9.pdf; Supplier: LCSC; brand: XSD(鑫顺达); ProductSize: 23.5*16*25MM; Colour: 白色; TextureOfMaterial: 6063-T5铝; SurfaceTreatment: 本色洗白; NumberOfNails: 2
U24 = TB6612FNG(O,C,8,EL: 双直流电机驱动器集成电路; Supplier Part: C88224; Manufacturer: TOSHIBA(东芝); Supplier Footprint: SSOP-24-208mil; JLCPCB Part Class: 扩展库; Datasheet: https://atta.szlcsc.com/upload/public/pdf/source/20171128/C141517_15118625624231147036.pdf; Supplier: LCSC
U25 = MAX31855KASA+T: 分辨率(位):14;供电电压:3V~3.6V;接口类型:SPI;; LCSC Part Name: 冷端补偿热电偶转数字转换器; Supplier Part: C52028; Manufacturer: ADI(亚德诺)/MAXIM(美信); Supplier Footprint: SO-8; JLCPCB Part Class: 扩展库; Datasheet: https://atta.szlcsc.com/upload/public/pdf/source/20200102/C476183_F86532FAEE27BC800DAB157AD9244C36.pdf; Supplier: LCSC; Resolution: 14; Number of Channels: 1; Supply Voltage: 3V~3.6V; Interface Type: SPI; Chip Type Parameters/Description: 冷端补偿热电偶到数字转换器; Operating Temperature: -40℃~+125℃
U27 = SHT30-DIS-B10KS: ±2%数字温湿度传感器（10-90%RH）; LCSC Part Name: 1-101173-01; Supplier Part: C2687423; Manufacturer: Sensirion(瑞士盛思锐); Supplier Footprint: DFN-8-EP(2.5x2.5); JLCPCB Part Class: 扩展库; Datasheet: https://atta.szlcsc.com/upload/public/pdf/source/20210120/C2687423_31DB3FACC3E95675626B9DEF500B4777.pdf; Supplier: LCSC; Supply Voltage: 2.4V~5.5V
U30 = MT3608: 功能类型:升压型;输出类型:可调;工作电压:2V~24V;输出电压:28V;输出电流:2A;; LCSC Part Name: 高效1.2MHz 2A升压转换器; Supplier Part: C84817; Manufacturer: 西安航天民芯; Supplier Footprint: SOT-23-6; JLCPCB Part Class: 扩展库; Datasheet: https://atta.szlcsc.com/upload/public/pdf/source/20161110/1478743351706.pdf; Supplier: LCSC; Function: 升压型; Output Type: 可调; Input Voltage: 2V~24V; Output Voltage: 28V; Output Current: 2A; Switching Frequency: 1.2MHz; Operating Temperature: -40℃~+85℃; Synchronous Rectification: 否; Number of Outputs: 1; Topology: 升压式; Quiescent Current (Iq): 200uA; Switch tube (built-in/external): 内置
U31 = PWR

## Nets
12V-1: D1.1(K) D2.1(K) D3.1(K) D4.1(K) H10.1 P1.3 U13.4(VS)
+3.3V: C11.2 C12.2 C20.1 C22.2 H5-3.3.1 H5-3.3.2 H5-3.3.3 H5-3.3.4 H8.1 LED1.1(+) R16.2 R17.2 U3.5(VOUT) U6-M1.15 U25.4(VCC) U27.5(VDD)
+5V: C2.1 C7.2 C9.2 C14.2 C15.1 C18.2 C19.2 C23.2 CN1.5 CN2.5 H3.1 H3-5.1 H3-5.2 H3-5.3 H3-5.4 H9.1 L2.2 P1.1 R8.2 R15.2 U3.1(VIN) U3.3(EN) U13.9(VSS) U14.3(OUT) U24.19(STBY) U24.20(VCC)
+12V: C5.2 C16.1 C17.1 H1-12.1 H1-12.2 H1-12.3 H1-12.4 R5.2 U2.2(IN) U4.2 U24.13(VM2) U24.14(VM3)
+12V-2: U24.24(VM1)
+12VUP: D9.1(K) DC1.1 R18.1 U4.1
GND: C2.2 C5.1 C6.1 C7.1 C9.1 C10.1 C11.1 C12.1 C13.2 C14.1 C15.2 C16.2 C17.2 C18.1 C19.1 C20.2 C22.1 C23.1 C24.1 C25.1 CN1.2 CN2.2 D5.2(A) D6.2(A) D7.2(A) D8.2(A) DC1.2 DC1.3 H2.1 H2.2 H2.3 H2.4 H4.1 H4.2 H4.3 H4.4 H6.1 H6.2 H6.3 H6.4 H7.2 H8.2 LED1.2(-) LED14.1(K) P1.2 R6.2 R9.1 R19.1 U2.4(GND) U3.2(GND) U5-M1.14 U6-M1.14 U13.1(Sense A) U13.8(GND) U13.15(Sense B) U14.4(GND) U23.1 U23.2 U24.3(PGND1) U24.4(PGND1) U24.9(PGND2) U24.10(PGND2) U24.18(GND) U25.1(GND) U27.2(ADDR) U27.6(nRESET) U27.7(R) U27.8(VSS) U27.9(EP) U30.2(GND) U31.2
AIN1: H11.6 U24.21(AIN1)
AIN2: H11.4 U24.22(AIN2)
AM1: CN2.4 H11.8
AM2: CN1.4 H11.7
AO1: CN2.1 U24.1(AO1) U24.2(AO1)
AO2: CN2.6 U24.5(AO2) U24.6(AO2)
BIN1: H11.5 U24.17(BIN1)
BIN2: H11.3 U24.16(BIN2)
BM1: CN2.3 H11.10
BM2: CN1.3 H11.9
BO1: CN1.1 U24.11(BO1) U24.12(BO1)
BO2: CN1.6 U24.7(BO2) U24.8(BO2)
C8: C8.1 L2.1 U2.3(SW)
EA: H9.2 U13.6(Enable A)
EB: H3.2 U13.11(Enable B)
FB: R7.1 U2.8(FB)
IN1: H5.4 U13.5(Input 1)
IN2: H5.3 U13.7(Input 2)
IN3: H5.2 U13.10(Input 3)
IN4: H5.1 U13.12(Input 4)
PWMA: H11.2 U24.23(PWMA)
PWMB: H11.1 U24.15(PWMB)
$1N1735: R5.1 U2.6(EN/SYNC)
$1N1737: C6.2 U2.7(VCC)
$1N1739: R6.1 U2.1(AAM)
$1N1742: R10.2 U2.5(BST)
$1N1745: R7.2 R8.1 R9.2
$1N1755: C10.2 U3.4(BP)
$1N1765: C8.2 R10.1
$1N1767: H7.15 U5-M1.1
$1N1768: H7.14 U5-M1.2
$1N1769: H7.13 U5-M1.3
$1N1770: H7.12 U5-M1.4
$1N1771: H7.11 U5-M1.5
$1N1772: H7.10 U5-M1.6
$1N1773: H7.9 U5-M1.7
$1N1774: H7.8 U5-M1.8
$1N1775: H7.7 U5-M1.9
$1N1776: H7.6 U5-M1.10
$1N1777: H7.5 U5-M1.11
$1N1778: H7.4 U5-M1.12
$1N1779: H7.3 U5-M1.13
$1N1781: H7.1 U5-M1.15
$1N1782: H8.15 U6-M1.1
$1N1783: H8.14 U6-M1.2
$1N1784: H8.13 U6-M1.3
$1N1785: H8.12 U6-M1.4
$1N1786: H8.11 U6-M1.5
$1N1787: H8.10 U6-M1.6
$1N1788: H8.9 U6-M1.7
$1N1789: H8.8 U6-M1.8
$1N1790: H8.7 U6-M1.9
$1N1791: H8.6 U6-M1.10
$1N1792: H8.5 U6-M1.11
$1N1793: H8.4 U6-M1.12
$1N1794: H8.3 U6-M1.13
$1N8770: C21.2 U25.3(T+) U26.2
$1N8790: C21.1 U25.2(T-) U26.1
$1N8843: H12.3 U25.5(SCK)
$1N8845: H12.1 U25.6(CS#)
$1N8847: H12.2 U25.7(SO)
$1N11564: H13.2 R16.1 U27.4(SCL)
$1N11568: H13.1 R17.1 U27.1(SDA)
$1N19408: D9.2(A) L3.1 U30.1(SW)
$1N19636: R18.2 R19.2 U30.3(FB)
$1N19998: C24.2 C25.2 L3.2 U29.1 U30.4(EN) U30.5(IN)
$1N20257: U29.2 U31.1
Net-(C13-1): C13.1 H10.2 U14.1(IN)
Net-(D1-2): D1.2(A) D5.1(K) U10.1 U13.2(OUT 1)
Net-(D2-2): D2.2(A) D6.1(K) U10.2 U13.3(OUT 2)
Net-(D3-2): D3.2(A) D7.1(K) U11.1 U13.13(Out3)
Net-(D4-2): D4.2(A) D8.1(K) U11.2 U13.14(Out4)
Net-(LED14-2): LED14.2(A) R15.1

Not connected (* = marked no-connect by the designer): U4 3*; U5 1; U6 1; U7 1; U12 1; U25 8(DNC)*; U27 3(ALERT)*; U29 3*; U30 6(NC)*

## Notes on the sheet
- esp
- 12-5v
- output
- esp
- 5-3.3v
